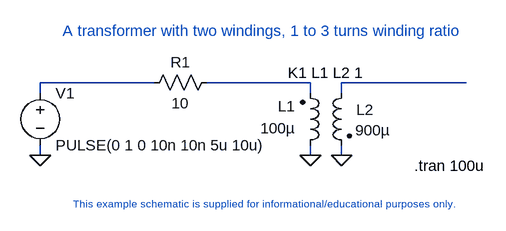
[diagram p0: schematic Transformer.asc]
Transformer.asc, the LTspice schematic file:
Version 4
SHEET 1 880 680
WIRE -128 176 -304 176
WIRE 112 176 -48 176
WIRE 352 176 160 176
WIRE -304 192 -304 176
WIRE 112 192 112 176
WIRE 160 192 160 176
WIRE -304 288 -304 272
WIRE 112 288 112 272
WIRE 160 288 160 272
FLAG -304 288 0
FLAG 160 288 0
FLAG 112 288 0
SYMBOL ind2 96 288 M180
WINDOW 0 -7 76 Right 2
WINDOW 3 -7 42 Right 2
SYMATTR InstName L1
SYMATTR Value 100µ
SYMATTR Type ind
SYMBOL ind2 176 176 M0
WINDOW 0 -7 42 Right 2
WINDOW 3 -5 73 Right 2
SYMATTR InstName L2
SYMATTR Value 900µ
SYMATTR Type ind
SYMBOL voltage -304 176 R0
SYMATTR InstName V1
SYMATTR Value PULSE(0 1 0 10n 10n 5u 10u)
SYMBOL res -32 160 R90
WINDOW 0 0 56 VBottom 2
WINDOW 3 32 56 VTop 2
SYMATTR InstName R1
SYMATTR Value 10
TEXT 136 176 Bottom 2 !K1 L1 L2 1
TEXT 272 304 Left 2 !.tran 100u
TEXT 32 352 Top 1 ;This example schematic is supplied for informational/educational purposes only.
TEXT 40 112 Bottom 2 ;A transformer with two windings, 1 to 3 turns winding ratio

The netlist it stands for:
* Transformer.asc
L1 0 N002 100µ
L2 N003 0 900µ
V1 N001 0 PULSE(0 1 0 10n 10n 5u 10u)
R1 N002 N001 10
K1 L1 L2 1
.tran 100u
* This example schematic is supplied for informational/educational purposes only.
* A transformer with two windings, 1 to 3 turns winding ratio
.backanno
.end